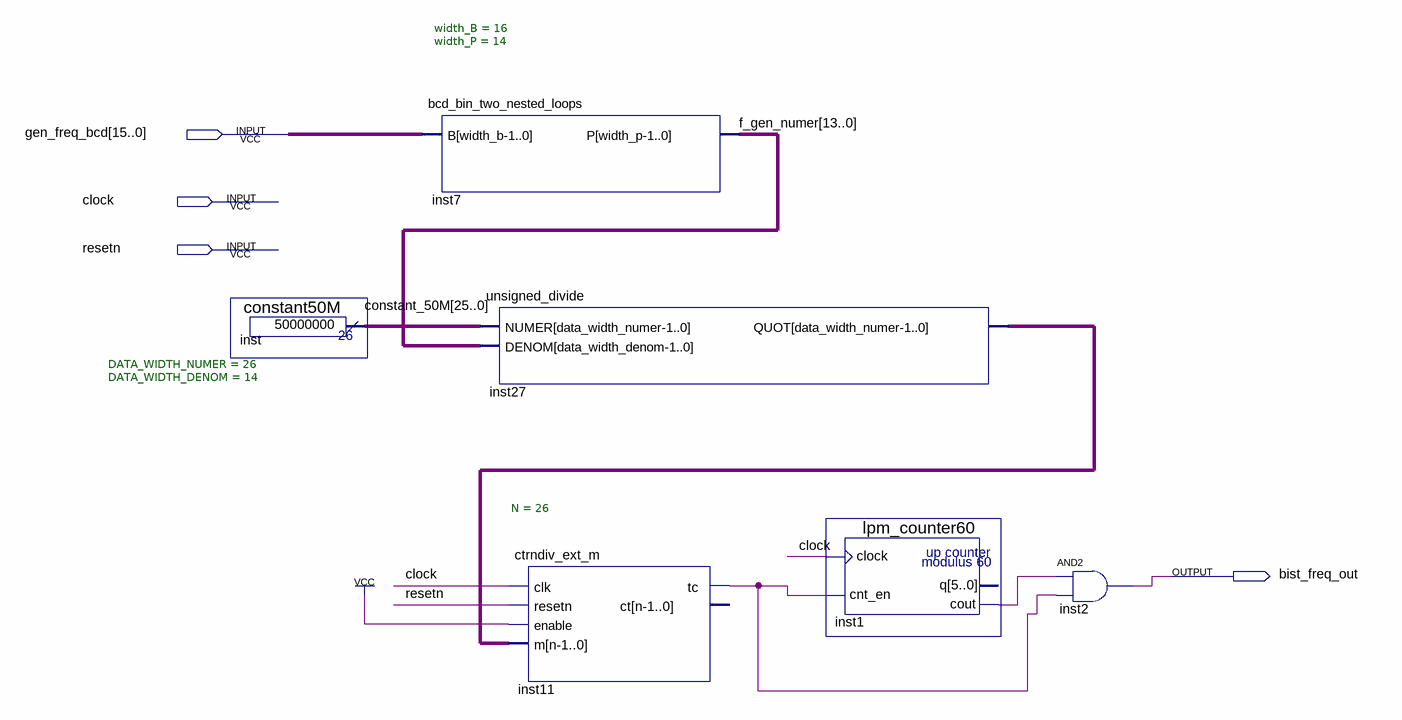
[diagram p0: schematic sheet]
// Quartus schematic freq_gen.bdf as structural Verilog: 6 symbols, 4 pins
module freq_gen (
  input  [15:0] gen_freq_bcd,
  input  clock,
  input  resetn,
  output bist_freq_out
);

  wire inst1_cout, inst11_tc;
  wire [13:0] f_gen_numer;
  wire [25:0] constant_50M, inst27_quot;

  constant50M inst (.result(constant_50M));
  bcd_bin_two_nested_loops #(.width_B(16), .width_P(14)) inst7 (.B(gen_freq_bcd), .P(f_gen_numer));
  unsigned_divide #(.DATA_WIDTH_NUMER(26), .DATA_WIDTH_DENOM(14)) inst27 (
    .NUMER(constant_50M), .DENOM(f_gen_numer), .QUOT(inst27_quot));
  ctrndiv_ext_m #(.N(26)) inst11 (
    .clk(clock), .resetn(resetn), .enable(1'b1), .m(inst27_quot), .tc(inst11_tc));  // open: ct
  lpm_counter60 inst1 (.clock(clock), .cnt_en(inst11_tc), .cout(inst1_cout));  // open: q
  and inst2 (bist_freq_out, inst1_cout, inst11_tc);
endmodule
